# Altium schematic sheet Board_Connector.SchDoc: Board_Connector
size A3; CompanyName: Reichle & De-Massari; Organization: Reichle & De-Massari; Address1: Binzstrasse 32; Address2: 8620 Wetzikon; Address3: Switzerland; DocumentNumber: 5; Revision: V0.2; SheetNumber: 5; SheetTotal: 5
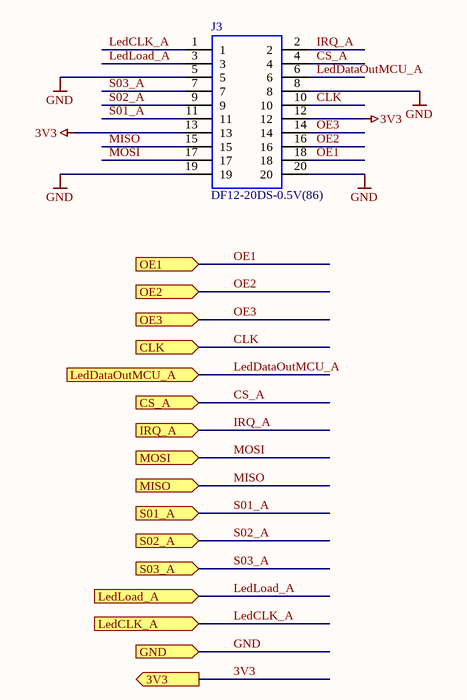
[diagram p0: Board_Connector.SchDoc]

## Parts
J3  DF12-20DS-0.5V(86)  [DF12-20DS]

## Ports
3V3 (out), CLK (in), CS_A (in), GND (in), IRQ_A (in), LedCLK_A (in), LedDataOutMCU_A (in), LedLoad_A (in), MISO (in), MOSI (in), OE1 (in), OE2 (in), OE3 (in), S01_A (in), S02_A (in), S03_A (in)

## Nets
3V3: J3.12 J3.13 ; port 3V3
GND: J3.5 J3.8 J3.19 J3.20 ; port GND
CLK: J3.10 ; port CLK
CS_A: J3.4 ; port CS_A
IRQ_A: J3.2 ; port IRQ_A
LedCLK_A: J3.1 ; port LedCLK_A
LedDataOutMCU_A: J3.6 ; port LedDataOutMCU_A
LedLoad_A: J3.3 ; port LedLoad_A
MISO: J3.15 ; port MISO
MOSI: J3.17 ; port MOSI
OE1: J3.18 ; port OE1
OE2: J3.16 ; port OE2
OE3: J3.14 ; port OE3
S01_A: J3.11 ; port S01_A
S02_A: J3.9 ; port S02_A
S03_A: J3.7 ; port S03_A

## Notes on the sheet
- Title
- Size:
- Date:
- A3
- Number:
- Time:
- Revision:
- Sheet
- of
- File:

## Library data of the parts
J3 = DF12-20DS-0.5V(86): Connector,Board to Board,DF12 Hirose DF12 Series 0.5mm 20 Way 2 Row Straight PCB Socket Surface Mount Board to Board; Allied_Number: R1051087; Manufacturer: Hirose; Manufacturer PartNr: DF12-20DS-0.5V(86); RS Part Number: 1722478; RS Price/Stock: http://uk.rs-online.com/web/p/products/1722478; Allied Price/Stock: http://www.alliedelec.com/hirose-electric-df12-20ds-0-5v-86-/R1051087/; Mouser Part Number: 798-DF12-20DS-0.5V86; Mouser Price/Stock: https://www.mouser.com/Search/Refine.aspx?Keyword=798-DF12-20DS-0.5V86; Datasheet Link: https://www.hirose.com/product/en/products/DF12